# EasyEDA Pro project pcb最终版.epro, board master control
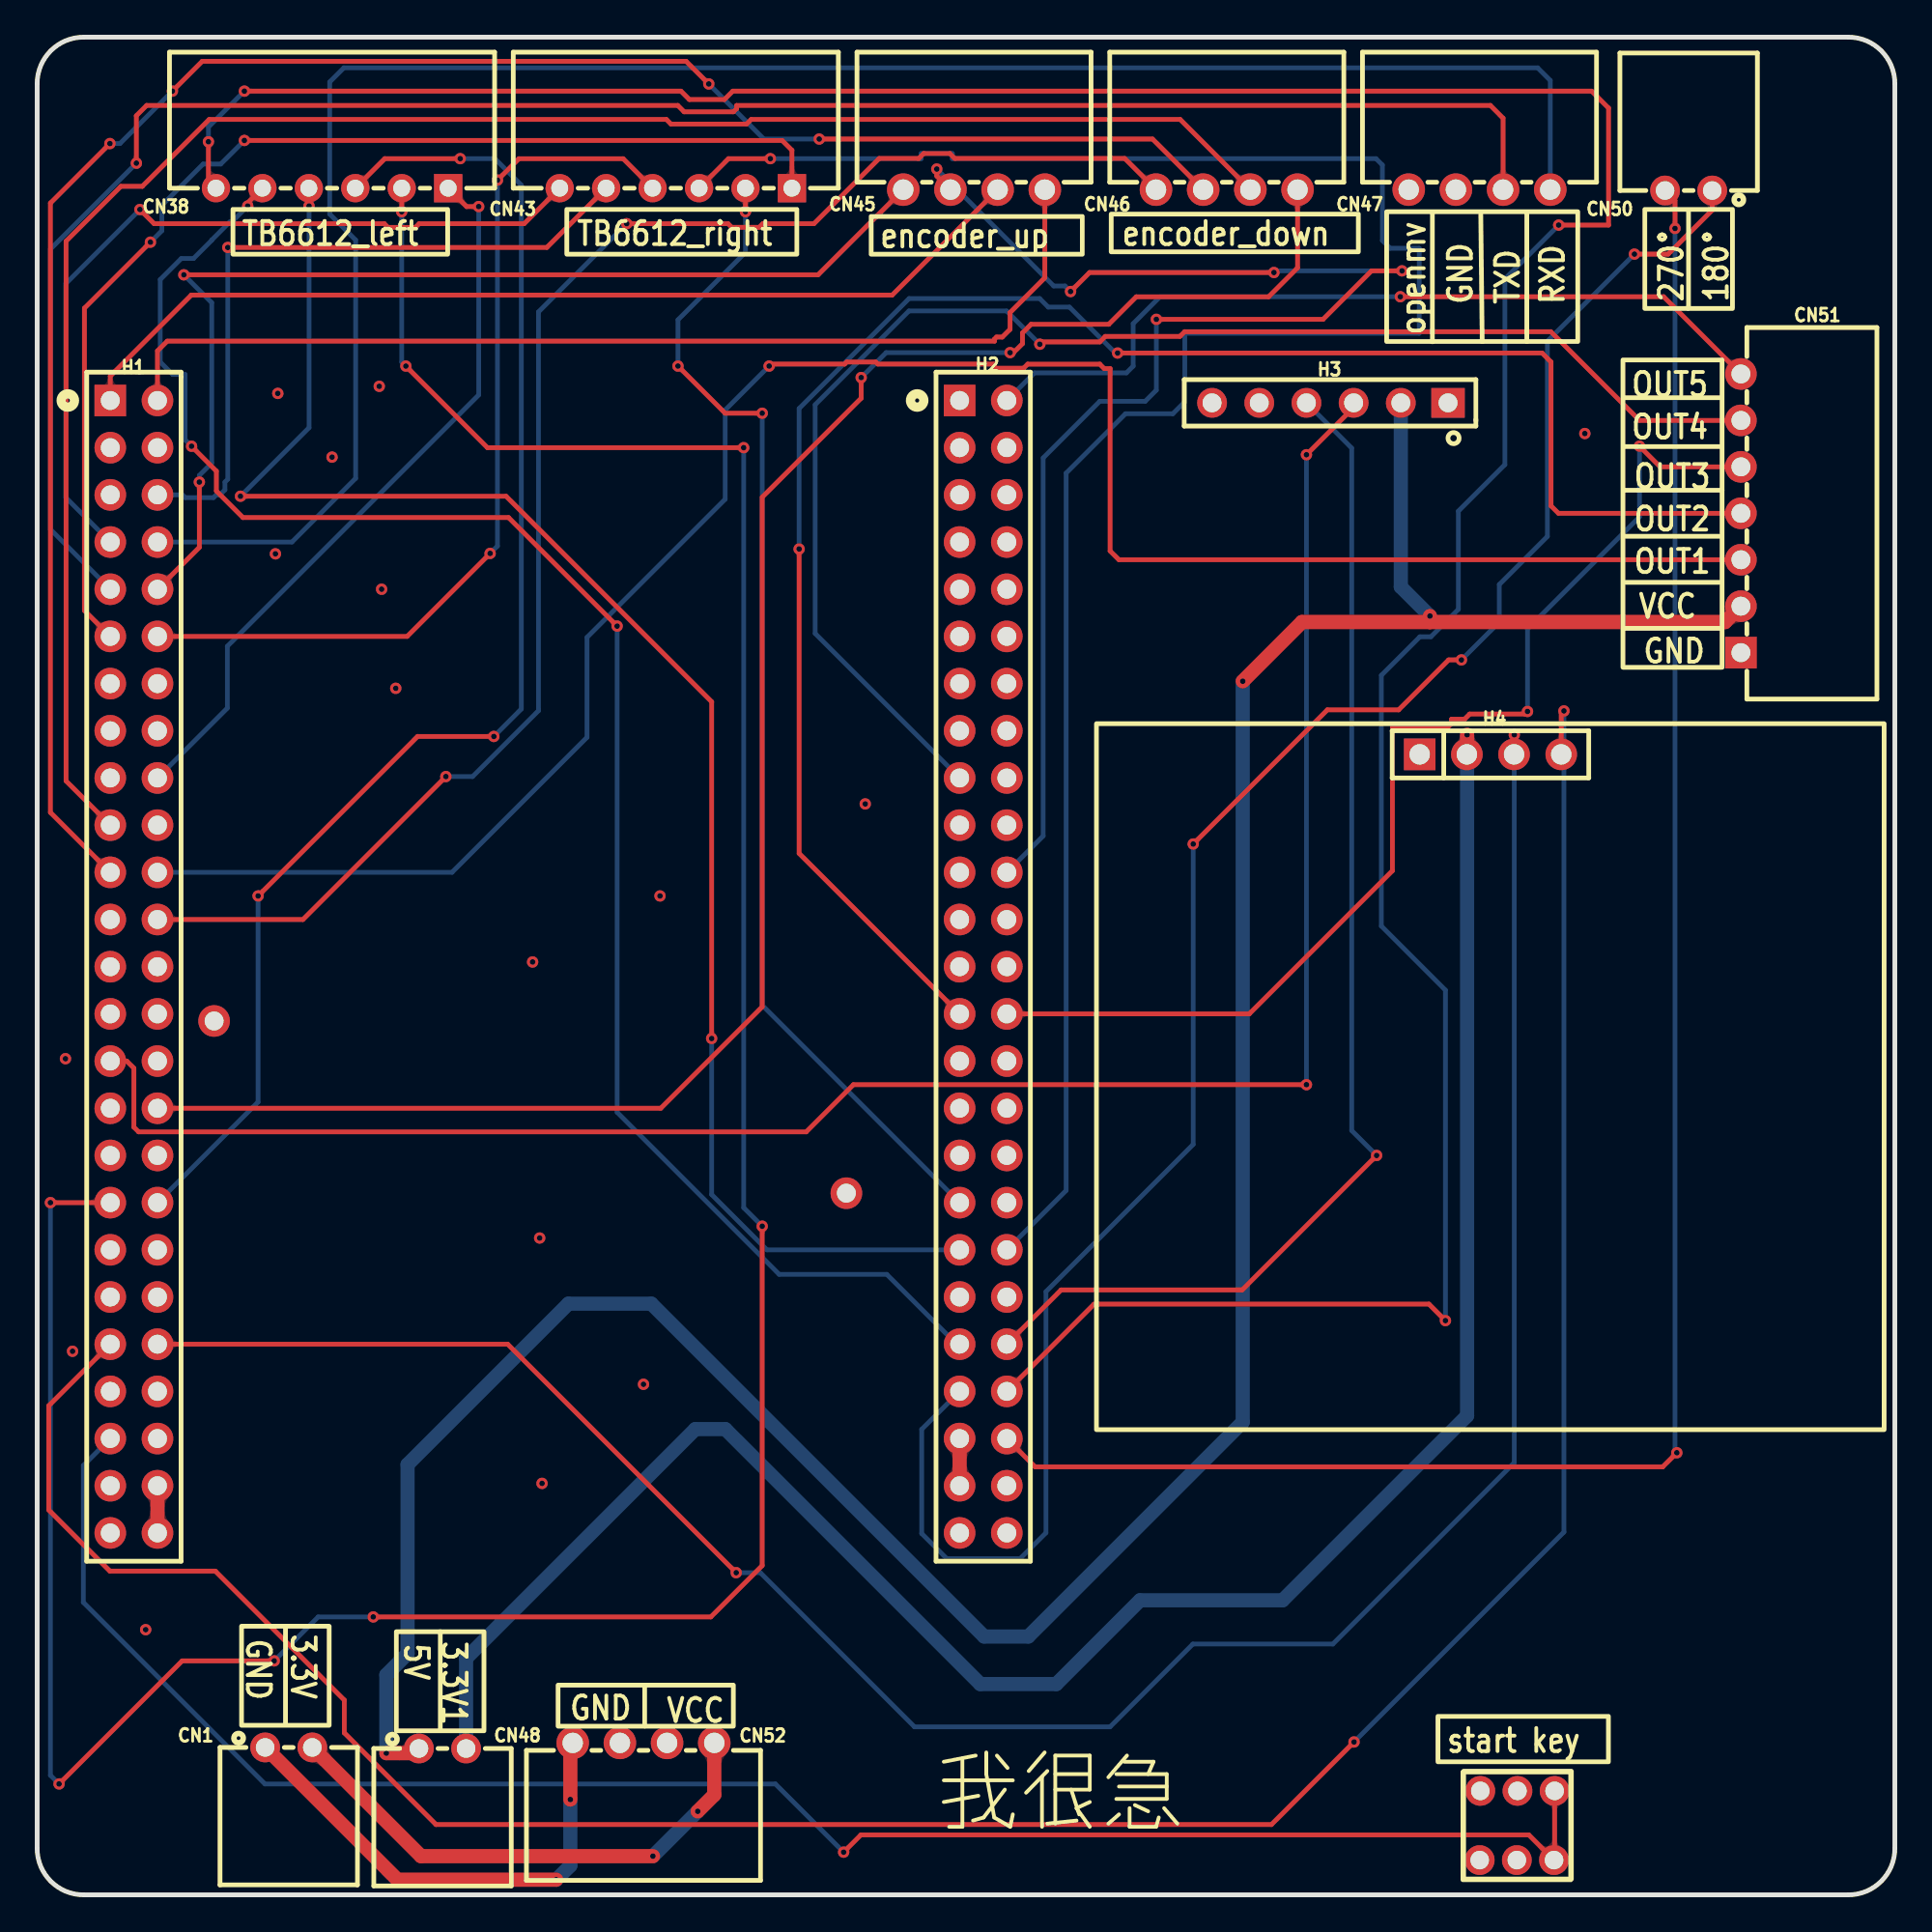
[diagram p3: board, top side]
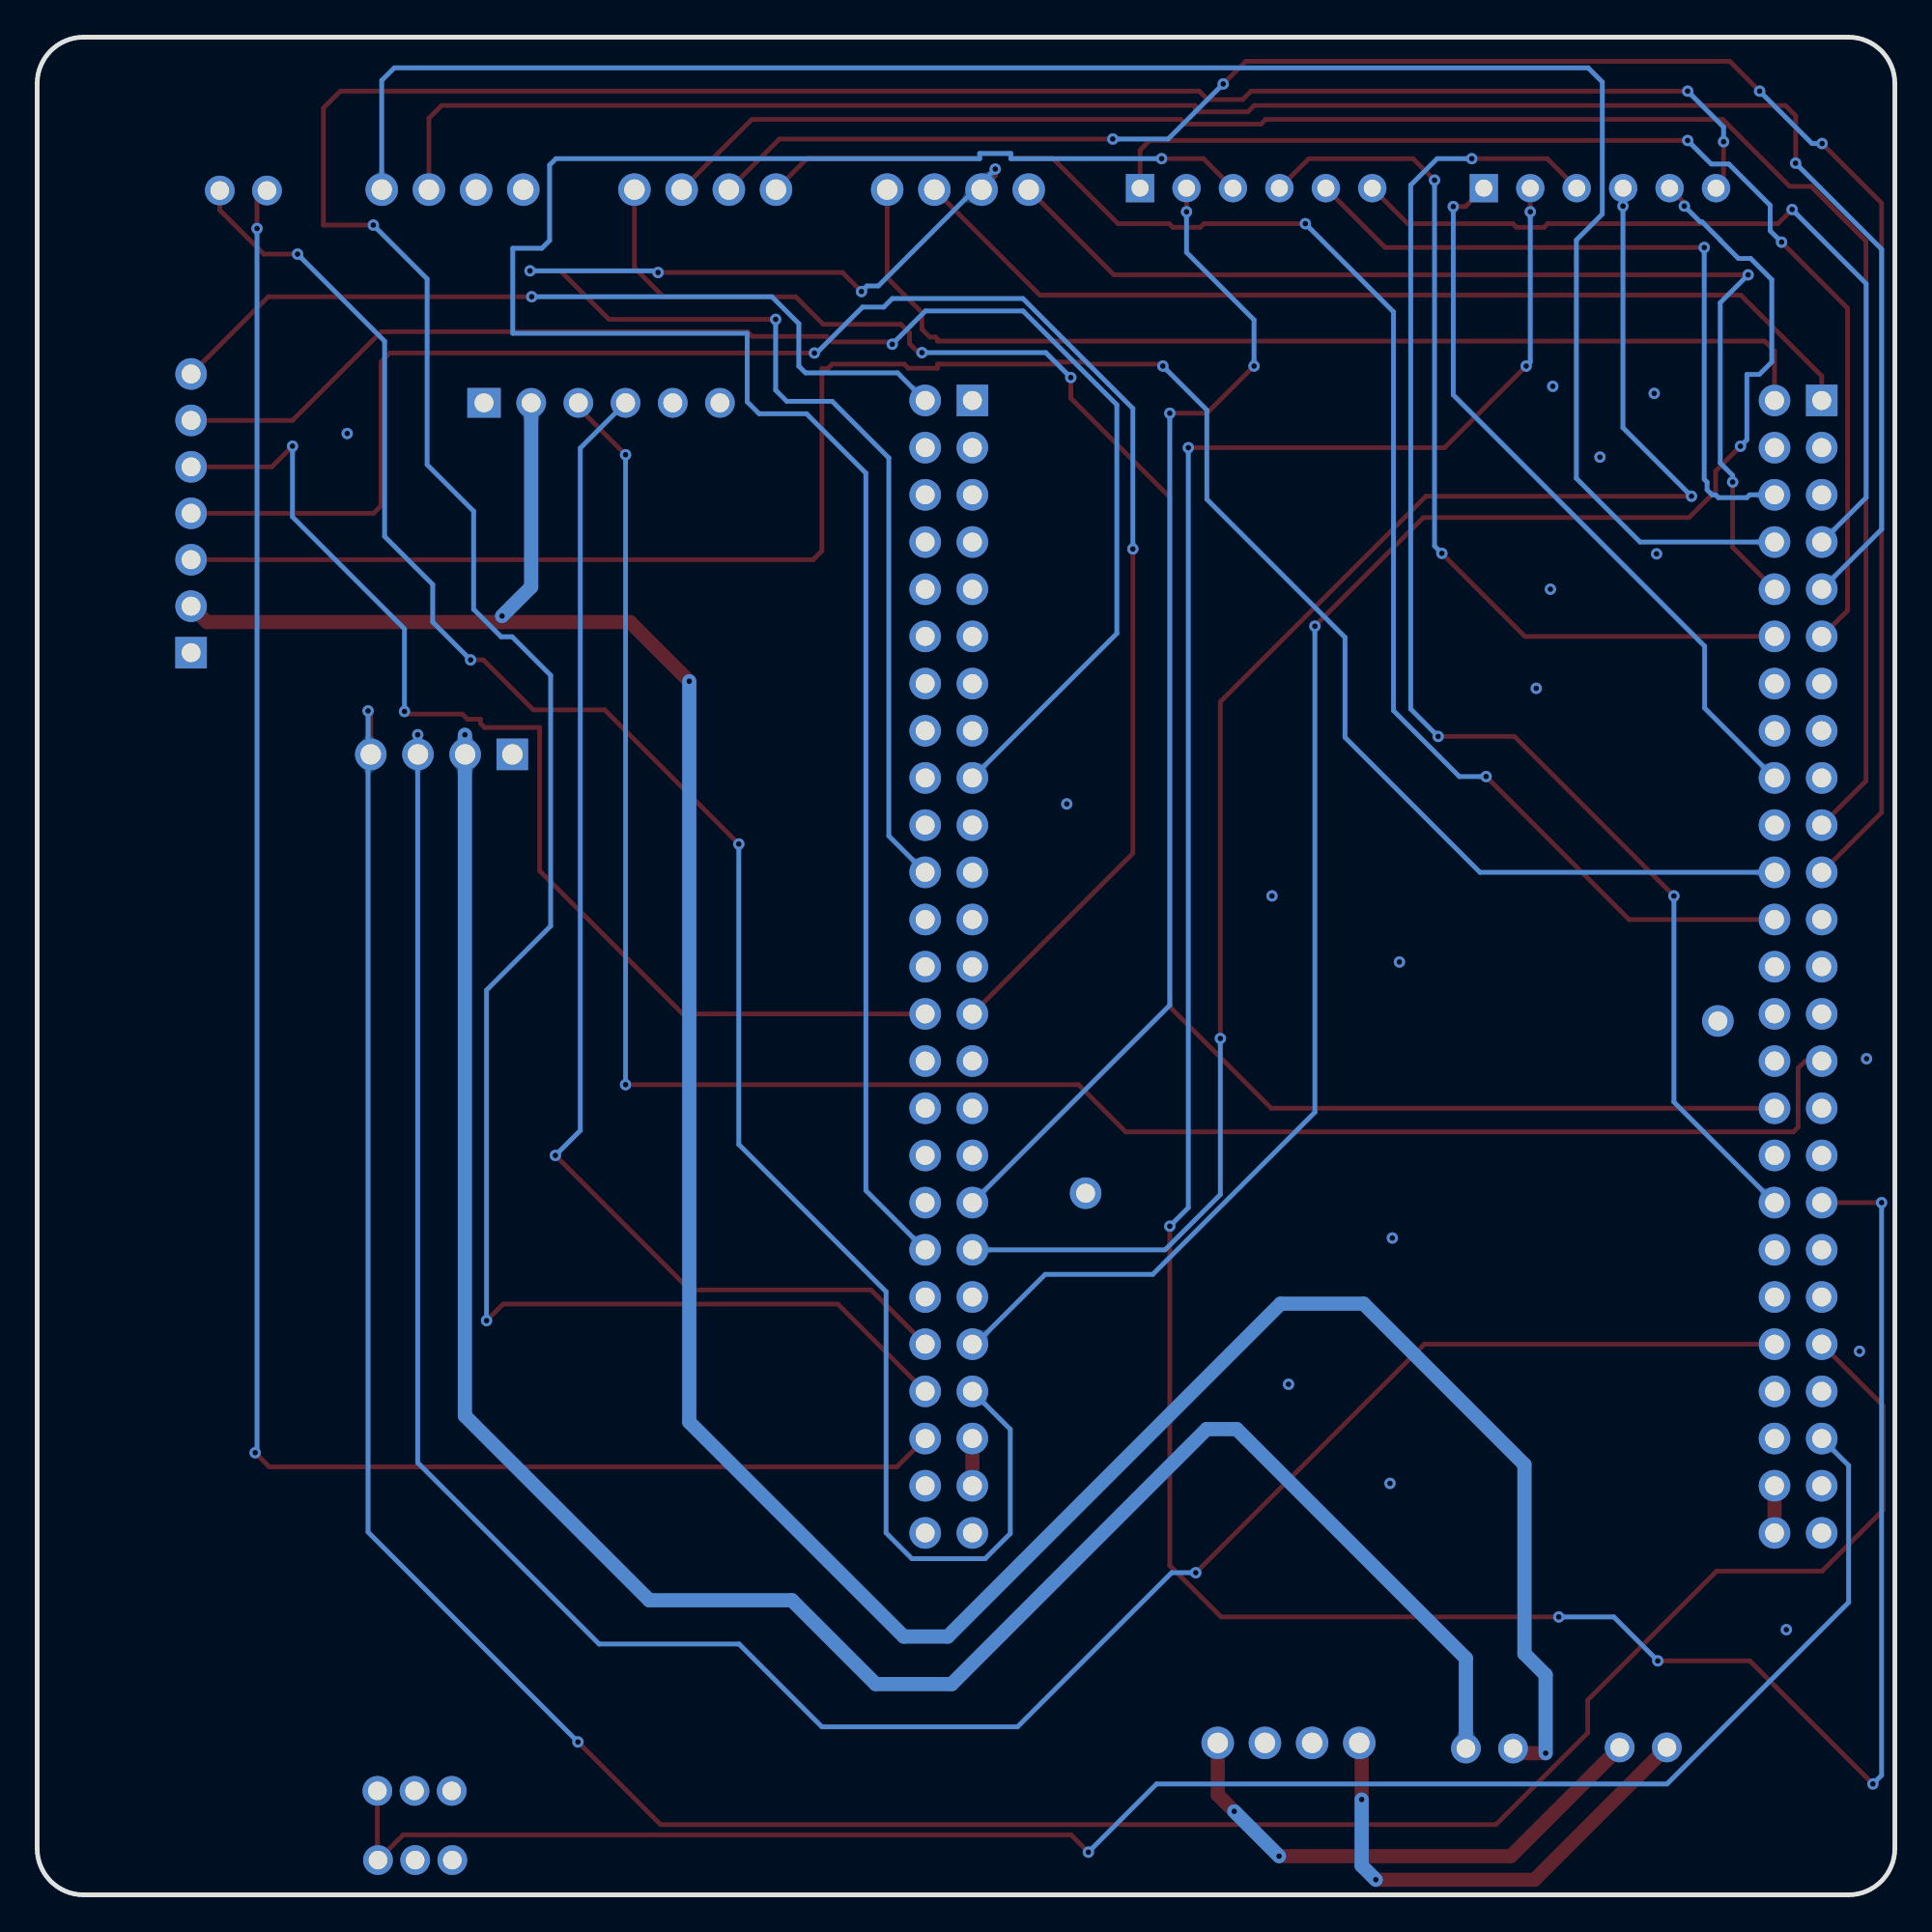
[diagram p4: board, bottom side, seen from below]

Outline 100 x 100 mm; copper layers: Top Layer, Bottom Layer. Coordinates in mm from the lower left corner of the outline.
Outline path: 0,97.5 0,2.5 arc(0.73,0.73) 2.5,0 97.5,0 arc(99.27,0.73) 100,2.5 100,97.5 arc(99.27,99.27) 97.5,100 2.5,100 arc(0.73,99.27) 0,97.5
Stack: Top Layer 0.035mm / Dielectric1 1.51mm FR4 er 4.5 / Bottom Layer 0.035mm

## Design rules (mm)
template: 我很急
spacing copperThickness1oz: track to track 0.102, other pairs 0.152 to 0.3
spacing copperThickness2oz (default): track to track 0.203, other pairs 0.203 to 0.203
spacing VCC和GND: track to track 0.762, other pairs 0.152 to 0.3
track width copperThickness1oz (default): min 0.254, default 0.254, max 1.016
track width copperThickness2oz: min 0.203, default 0.254, max 2.54
track width VCC AND GND: min 0.254, default 0.762, max 0.762
track width 9.6V: min 0.762, default 1.016, max 1.016
differential pair differentialPair (default): width min 0.127, default 0.254, max 2.54; gap min 0.152, default 0.152
via viaSize (default): diameter min 0.5, default 0.61, max 10; hole min 0.3, default 0.305, max 6.299
net GND uses VCC AND GND
net 5V uses VCC AND GND
net VREF uses VCC AND GND
net 3.3V uses VCC AND GND
net 3.3V1 uses VCC AND GND

## Placement (name value [footprint] x y rotation side)
CN1  3.3V  [CONN-TH_XH-2AW_C2908611]  13.54 7.94 0 top
CN38  TB6612 1  [CONN-TH_6P-P2.50_HC-XH-6AW-G]  15.88 91.87 180 top
CN43  TB6612 1  [CONN-TH_6P-P2.50_HC-XH-6AW-G]  34.38 91.87 180 top
CN45  编码器上  [CONN-TH_XH-4AW]  50.43 91.79 180 top
CN46  编码器下  [CONN-TH_XH-4AW]  64.04 91.79 180 top
CN47  openmv  [CONN-TH_XH-4AW]  77.64 91.79 180 top
CN48  3.3V  [CONN-TH_XH-2AW_C2908611]  21.82 7.88 0 top
CN50  SERVO  [CONN-TH_XH-2AW_C2908611]  88.9 91.75 180 top
CN51  HC-XH-7AW-G  [CONN-TH_7P-P2.50_HC-XH-7AW-G]  91.71 74.37 90 top
CN52  XH-4AW  [CONN-TH_XH-4AW]  32.64 8.18 0 top
H1  FH-00077  [HDR-TH_50P-P2.54-V-F-R2-C25-S2.54-1]  5.21 49.96 270 top
H2  FH-00077  [HDR-TH_50P-P2.54-V-F-R2-C25-S2.54-1]  50.93 49.96 270 top
H3  PM254V-11-06-H85  [HDR-TH_6P-P2.54-V-F]  69.6 80.31 180 top
H4  PM254V-11-04-H85  [HDR-TH_4P-P2.54-V-F]  78.23 61.39 0 top
NOREF  -  [Pad_e45397]  9.53 47.04 270 top
NOREF#2  -  [Pad_e45396]  43.56 37.77 270 top
U1  -  [按键开关]  77.42 5.77 0 top
U2  -  [按键开关]  81.91 1.7 180 top

## Footprints (pads in the part's own frame, mm; a bottom-side part is the same pattern mirrored in y, then rotated)
CONN-TH_6P-P2.50_HC-XH-6AW-G
  rect 1.524x1.524 hole 0.914: 1(-6.25,0)
  round 1.524 hole 0.914: 2(-3.75,0) 3(-1.25,0) 4(1.25,0) 5(3.75,0) 6(6.25,0)
CONN-TH_7P-P2.50_HC-XH-7AW-G
  rect 1.7x1.7 hole 1.02: 1(-7.5,0)
  round 1.7 hole 1.02: 2(-5,0) 3(-2.5,0) 4(0,0) 5(2.5,0) 6(5,0) 7(7.5,0)
CONN-TH_XH-2AW_C2908611
  round 1.6 hole 1: 1(-1.27,0) 2(1.27,0)
CONN-TH_XH-4AW
  round 1.75 hole 1.1: 1(-3.81,0) 2(-1.27,0) 3(1.27,0) 4(3.81,0)
HDR-TH_4P-P2.54-V-F
  rect 1.7x1.7 hole 1.1: 1(-3.81,0)
  round 1.7 hole 1.1: 2(-1.27,0) 3(1.27,0) 4(3.81,0)
HDR-TH_6P-P2.54-V-F
  rect 1.8x1.6 hole 1.02: 1(-6.35,0)
  round 1.6 hole 1.02: 2(-3.81,0) 3(-1.27,0) 4(1.27,0) 5(3.81,0) 6(6.35,0)
HDR-TH_50P-P2.54-V-F-R2-C25-S2.54-1
  rect 1.7x1.7 hole 1.02: 1(-30.48,-1.27)
  round 1.7 hole 1.02: 2(-30.48,1.27) 3(-27.94,-1.27) 4(-27.94,1.27) 5(-25.4,-1.27) 6(-25.4,1.27) 7(-22.86,-1.27) 8(-22.86,1.27) 9(-20.32,-1.27) 10(-20.32,1.27) 11(-17.78,-1.27) 12(-17.78,1.27) 13(-15.24,-1.27) 14(-15.24,1.27) 15(-12.7,-1.27) 16(-12.7,1.27) 17(-10.16,-1.27) 18(-10.16,1.27) 19(-7.62,-1.27) 20(-7.62,1.27) 21(-5.08,-1.27) 22(-5.08,1.27) 23(-2.54,-1.27) 24(-2.54,1.27) 25(0,-1.27) 26(0,1.27) 27(2.54,-1.27) 28(2.54,1.27) 29(5.08,-1.27) 30(5.08,1.27) 31(7.62,-1.27) 32(7.62,1.27) 33(10.16,-1.27) 34(10.16,1.27) 35(12.7,-1.27) 36(12.7,1.27) 37(15.24,-1.27) 38(15.24,1.27) 39(17.78,-1.27) 40(17.78,1.27) 41(20.32,-1.27) 42(20.32,1.27) 43(22.86,-1.27) 44(22.86,1.27) 45(25.4,-1.27) 46(25.4,1.27) 47(27.94,-1.27) 48(27.94,1.27) 49(30.48,-1.27) 50(30.48,1.27)
Pad_e45396
  round 1.7 hole 1.02: 1(0,0)
Pad_e45397
  round 1.7 hole 1.02: 51(0,0)
按键开关
  round 1.6 hole 1: 1(0.263,-0.17) 1(2.263,-0.17) 1(4.263,-0.17)

## Nets
As in the schematic, except:
3.3V: CN1.2 CN52.4
5V: CN48.1 CN51.2 H3.2
5V5: H1.48 H1.50
GND: CN1.1 CN47.3 CN51.1 CN52.1 H1.47 H1.49 H2.50 H3.5 H4.1 NOREF.51 NOREF#2.1 U1.1 U2.1

## Via types
v1: diameter 0.61, hole 0.305, Top Layer to Bottom Layer, 92 vias

## Routing (per net, layer and track width the routed paths; a pad name or vN(x,y) marks a point on that pad's centre or on a via; arc(x,y) is an arc through that point)
3.3V: length 28.2
  Top Layer w0.762: v1(35.56,4.5) 36.45,5.38 CN52.4 ; CN1.2 20.67,2.08 v1(33.15,2.08)
  Bottom Layer w0.762: v1(33.15,2.08) v1(35.56,4.5)
3.3V1: length 113.2
  Top Layer w0.762: H4.2 76.96,61.91 76.97,61.92 v1(76.97,62.45)
  Bottom Layer w0.762: CN48.2 23.09,12.73 35.43,25.07 37.05,25.07 50.77,11.35 54.86,11.35 59.37,15.86 67.05,15.86 76.97,25.79 v1(76.97,62.45)
5V: length 159.4
  Top Layer w0.762: v1(64.9,65.33) 68.08,68.52 74.97,68.52 ; v1(18.8,7.63) 20.3,7.63 CN48.1 ; 74.97,68.52 90.86,68.52 CN51.2 ; 74.97,68.52 v1(74.97,68.84)
  Bottom Layer w0.762: v1(74.97,68.84) 73.41,70.41 H3.2 ; v1(64.9,65.33) 64.9,25.45 53.35,13.9 50.98,13.9 33.06,31.82 28.6,31.82 19.94,23.16 19.94,12.98 18.8,11.84 v1(18.8,7.63)
5V5: length 2.5
  Top Layer w0.762: H1.48 H1.50
GND: length 26.4
  Top Layer w0.762: v1(27.94,0.81) 19.39,0.81 CN1.1 ; v1(28.7,5.13) 28.7,8.05 CN52.1
  Bottom Layer w0.762: v1(27.94,0.81) 28.7,1.57 v1(28.7,5.13)
  vias: v1(1.52,45.01) v1(1.91,29.26) v1(5.84,14.28) v1(12.83,72.19) v1(12.95,80.82) v1(15.88,77.39) v1(18.42,81.2) v1(18.54,70.28) v1(19.3,64.95) v1(26.67,50.22) v1(27.05,35.36) v1(27.18,22.15) v1(32.64,27.48) v1(33.53,53.77) v1(44.58,58.72) v1(83.31,78.66)
PA1: length 105.2
  Top Layer w0.254: CN50.2 88.17,91.21 v1(88.17,89.7) ; H2.46 53.72,23.04 87.5,23.04 v1(88.26,23.8)
  Bottom Layer w0.254: v1(88.26,23.8) 88.17,23.9 v1(88.17,89.7)
PA2: length 107.2
  Top Layer w0.254: v1(85.98,88.32) 87.8,88.32 90.17,90.69 CN50.1 ; v1(62.23,56.57) 69.45,63.79 73.29,63.79 75.98,66.48 v1(76.67,66.48)
  Bottom Layer w0.254: v1(62.23,56.57) 62.23,40.4 54.3,32.47 54.3,19.49 52.91,18.1 48.97,18.1 47.62,19.45 47.62,25.06 H2.43 ; v1(85.98,88.32) 81.3,83.63 81.3,73.12 78.71,70.54 78.71,68.52 v1(76.67,66.48)
PA3: length 66.2
  Top Layer w0.254: v1(72.1,39.8) 64.87,32.56 55.12,32.56 H2.42
  Bottom Layer w0.254: v1(72.1,39.8) 70.76,41.14 70.76,77.88 H3.4
PA6: length 40
  Top Layer w0.254: v1(23.77,90.88) 23.12,90.88 CN38.1
  Bottom Layer w0.254: H1.18 10.24,63.88 10.24,67.21 23.77,80.74 v1(23.77,90.88)
PA7: length 89.2
  Top Layer w0.254: CN38.4 14.64,91.86 v1(14.64,90.91) ; v1(36.31,46.1) 36.31,64.22 25.24,75.29 v1(10.95,75.29)
  Bottom Layer w0.254: v1(10.95,75.29) 14.64,78.98 v1(14.64,90.91) ; H2.37 39.28,34.72 36.31,37.7 v1(36.31,46.1)
PA8: length 59.4
  Top Layer w0.254: CN45.4 42.04,87.21 v1(7.9,87.21) ; H1.10 8.73,72.54 v1(8.73,76.05)
  Bottom Layer w0.254: v1(8.73,76.05) 8.73,76.41 9.4,77.08 9.4,85.71 v1(7.9,87.21)
PA15: length 84.4
  Top Layer w0.254: H1.24 14.31,52.5 v1(22,60.2) ; CN46.4 58.55,93.47 49.4,93.47 49.13,93.74 47.72,93.74 47.45,93.47 45.32,93.47 41.81,89.96 39.07,89.96 38.87,89.76 37.39,89.76 37.19,89.96 v1(31.74,89.96)
  Bottom Layer w0.254: v1(22,60.2) 23.44,60.2 26.99,63.74 26.99,85.21 v1(31.74,89.96)
PB3: length 105.4
  Top Layer w0.254: v1(36.16,97.48) 34.94,98.7 8.89,98.7 v1(7.28,97.09) ; H1.21 0.71,58.26 0.71,91.07 v1(3.92,94.27) ; v1(42.1,94.52) 60.04,94.52 CN46.3
  Bottom Layer w0.254: v1(42.1,94.52) 39.12,94.52 v1(36.16,97.48) ; v1(3.92,94.27) 4.46,94.27 v1(7.28,97.09)
PB4: length 98.8
  Top Layer w0.254: v1(43.41,2.3) 44.34,3.23 80.3,3.23 81.65,1.87 81.69,1.91 81.69,5.6
  Bottom Layer w0.254: v1(43.41,2.3) 39.74,5.97 12.26,5.97 2.49,15.74 2.49,23.11 H1.45
PB6: length 100.7
  Top Layer w0.254: H1.19 1.56,59.96 1.56,89.02 4.51,91.97 5.66,91.97 9.26,95.57 33.87,95.57 34.12,95.32 38.19,95.32 38.44,95.57 61.53,95.57 CN46.2
PB7: length 101.4
  Top Layer w0.254: CN46.1 67.85,87.58 66.29,86.02 59.17,86.02 57.69,84.54 53.51,84.54 53.04,84.08 53.04,83.5 52.56,83.02 v1(52.37,83.02) ; H1.32 33.57,42.34 39.03,47.8 39.03,75.24 44.36,80.57 v1(44.36,81.68)
  Bottom Layer w0.254: v1(52.37,83.02) 45.7,83.02 v1(44.36,81.68)
PB11: length 113
  Top Layer w0.254: CN51.3 58.23,71.87 57.76,72.34 57.76,82.16 57.44,82.16 57.2,82.4 53.32,82.4 53.1,82.18 51.53,82.18 51.53,82.37 51.51,82.4 45.25,82.4 45.14,82.51 43.58,82.51 43.46,82.4 39.51,82.4 v1(39.4,82.3)
  Bottom Layer w0.254: H1.22 22.33,55.04 29.6,62.31 29.6,67.69 37.04,75.13 37.04,79.93 v1(39.4,82.3)
PB12: length 98.6
  Top Layer w0.254: H2.27 41.02,56.06 v1(41.02,72.45) ; v1(58.16,83) 81.01,83 81.49,82.52 81.49,74.77 81.89,74.37 CN51.4
  Bottom Layer w0.254: v1(58.16,83) 58.04,83 55.57,85.47 54.43,85.47 53.97,85.93 46.94,85.93 41.02,80.01 v1(41.02,72.45)
PB13: length 62.1
  Top Layer w0.254: CN51.5 87.37,76.87 v1(86.25,77.98) ; H2.28 65.25,47.42 72.95,55.13 72.95,62.83 75.91,62.83 76.14,63.06 76.14,63.28 76.84,63.28 77.11,63.56 80.09,63.56 v1(80.23,63.7)
  Bottom Layer w0.254: v1(80.23,63.7) 80.23,68.15 86.25,74.17 v1(86.25,77.98)
PB15: length 44.9
  Top Layer w0.254: v1(73.38,86.03) 87.56,86.03 CN51.7
  Bottom Layer w0.254: v1(73.38,86.03) 60.45,86.03 59,84.58 59,82.29 58.64,81.93 53.68,81.93 H2.2
PC0: length 75.5
  Top Layer w0.254: v1(24.58,62.36) 20.48,62.36 v1(11.89,53.77) ; v1(22.77,93.46) 18.71,93.46 CN38.3
  Bottom Layer w0.254: v1(11.89,53.77) 11.89,42.68 H1.36 ; v1(24.58,62.36) 26.06,63.84 26.06,92.03 24.64,93.46 v1(22.77,93.46)
PC1: length 167.7
  Top Layer w0.254: v1(19.85,82.29) 24.24,77.9 v1(38.03,77.9) ; H1.35 v1(0.71,37.26) ; v1(12.76,12.59) 7.8,12.59 v1(1.18,5.97) ; v1(18.09,14.96) 36.26,14.96 39.03,17.73 v1(39.03,35.99) ; v1(19.62,90.6) CN38.2
  Bottom Layer w0.254: v1(18.09,14.96) 15.13,14.96 v1(12.76,12.59) ; v1(0.71,37.26) 0.71,6.44 v1(1.18,5.97) ; v1(39.03,35.99) 38.03,36.99 v1(38.03,77.9) ; v1(19.85,82.29) 19.62,82.52 v1(19.62,90.6)
PC2: length 95
  Top Layer w0.254: v1(8.31,77.98) 9.65,76.64 9.65,75.57 11.08,74.14 25.38,74.14 v1(31.22,68.3) ; v1(11.33,90.91) 11.33,91.08 CN38.5
  Bottom Layer w0.254: H2.41 49.49,29.64 45.74,33.4 39.95,33.4 31.22,42.13 v1(31.22,68.3) ; v1(11.33,90.91) 10.47,90.05 10.37,90.05 9.4,89.08 9.4,89.07 8.42,88.09 7.76,88.09 6.63,86.95 6.63,82.51 7.3,81.84 7.97,81.84 7.97,78.32 v1(8.31,77.98)
PC3: length 180
  Top Layer w0.254: H2.44 56.9,31.8 74.92,31.8 v1(75.81,30.91) ; v1(9.22,94.37) 9.22,92.28 CN38.6 ; v1(11.15,97.09) 34.66,97.09 35.11,96.64 36.99,96.64 37.45,97.09 83.68,97.09 84.59,96.18 84.59,89.88 v1(81.91,89.88)
  Bottom Layer w0.254: v1(11.15,97.09) 9.22,95.16 v1(9.22,94.37) ; v1(75.81,30.91) 75.81,48.7 72.36,52.15 72.36,65.65 74.43,67.72 75.03,67.72 76.5,69.2 76.5,74.48 79.01,76.99 79.01,86.99 v1(81.91,89.88)
PC4: length 116.4
  Top Layer w0.254: CN43.3 37.22,93.46 v1(39.47,93.46)
  Bottom Layer w0.254: v1(39.47,93.46) 47.59,93.46 47.59,93.74 49.26,93.74 49.26,93.46 72.07,93.46 72.41,93.12 72.41,89.05 72.83,88.64 74.4,88.64 74.4,84.06 61.78,84.06 61.78,80.37 61.13,79.73 58.58,79.73 55.39,76.53 55.39,37.92 H2.38
PC5: length 63.6
  Top Layer w0.254: v1(38.13,90.6) CN43.2 ; v1(39.03,79.76) 37.03,79.76 v1(34.5,82.3)
  Bottom Layer w0.254: v1(39.03,79.76) 39.03,47.89 H2.35 ; v1(34.5,82.3) 34.5,84.78 38.13,88.42 v1(38.13,90.6)
PC6: length 53.2
  Top Layer w0.254: H1.1 3.94,81.76 8.3,86.12 46.03,86.12 CN45.2
PC7: length 57.4
  Top Layer w0.254: H1.2 6.48,83.11 7,83.64 51.53,83.64 51.53,83.75 51.64,83.86 51.95,83.86 52.37,84.28 52.37,85.18 54.24,87.05 CN45.1
PC8: length 63.1
  Top Layer w0.254: v1(6.1,88.96) 2.55,85.41 2.55,69.13 H1.11 ; CN43.1 40.63,93.92 40.1,94.44 v1(11.15,94.44)
  Bottom Layer w0.254: v1(11.15,94.44) 9.89,93.17 8.93,93.17 6.71,90.95 6.71,89.58 v1(6.1,88.96)
PC9: length 49.5
  Top Layer w0.254: H1.12 19.92,67.74 v1(24.38,72.21) ; v1(24.78,92.3) 25.93,93.46 31.54,93.46 CN43.4
  Bottom Layer w0.254: v1(24.38,72.21) 24.78,72.61 v1(24.78,92.3)
PC10: length 38.7
  Top Layer w0.254: CN43.5 27.44,88.68 v1(10.26,88.68)
  Bottom Layer w0.254: H1.6 7.82,75.36 7.97,75.21 9.49,75.21 9.64,75.36 9.84,75.36 10.11,75.63 10.11,76.05 10.26,76.2 v1(10.26,88.68)
PC11: length 44.4
  Top Layer w0.254: CN43.6 26.22,89.96 20.56,89.96 20.37,89.76 18.89,89.76 18.69,89.96 6.3,89.96 v1(5.53,90.72)
  Bottom Layer w0.254: v1(5.53,90.72) 1.54,86.73 1.54,75.22 H1.7
PC12: length 107.1
  Top Layer w0.254: CN47.2 78.91,95.64 78.23,96.32 37.65,96.32 37.65,96.15 37.48,95.98 34.83,95.98 34.49,96.32 5.89,96.32 5.34,95.77 5.34,93.22 v1(5.34,93.22)
  Bottom Layer w0.254: v1(5.34,93.22) 0.71,88.58 0.71,73.51 H1.9
PD2: length 106.2
  Bottom Layer w0.254: CN47.1 81.45,97.67 80.77,98.35 16.51,98.35 15.75,97.59 15.75,90.47 17.14,89.08 17.14,76.25 13.72,72.82 H1.8
PD5: length 106.6
  Top Layer w0.254: v1(68.33,77.52) 70.87,80.06 H3.3 ; H1.29 4.83,44.88 5.21,44.5 5.21,41.33 5.46,41.07 41.4,41.07 43.94,43.61 v1(68.33,43.61)
  Bottom Layer w0.254: v1(68.33,77.52) v1(68.33,43.61)
PE11: length 78.5
  Top Layer w0.254: v1(60.25,84.81) 69.22,84.81 71.83,87.42 v1(73.47,87.42) ; 49.16,91.79 48.43,92.53 v1(48.43,92.9) ; v1(55.63,86.31) 56.65,87.33 v1(66.58,87.33)
  Bottom Layer w0.254: v1(48.43,92.9) 54.72,86.61 55.33,86.61 v1(55.63,86.31) ; H2.22 54.16,57 54.16,77.35 57.2,80.4 59.64,80.4 60.25,81 v1(60.25,84.81) ; v1(73.47,87.42) 66.67,87.42 v1(66.58,87.33)
PE13: length 78.2
  Top Layer w0.254: CN51.6 86.26,79.37 81.48,84.14 61.77,84.14 61.51,83.89 57.5,83.89 57.2,83.6 54.1,83.6 v1(53.97,83.47)
  Bottom Layer w0.254: v1(53.97,83.47) 52.18,85.26 46.93,85.26 41.88,80.21 41.88,67.9 H2.17
PG11: length 153
  Top Layer w0.254: H1.41 0.63,26.33 0.63,20.72 3.92,17.43 9.59,17.43 16.53,10.49 16.53,8.72 21.47,3.78 66.44,3.78 v1(70.89,8.23) ; H4.4 82.04,63.59 v1(82.19,63.73)
  Bottom Layer w0.254: v1(82.19,63.73) 82.19,19.53 v1(70.89,8.23)
PG12: length 127.7
  Top Layer w0.254: H4.3 79.5,62.43 v1(79.51,62.45) ; v1(37.63,17.34) 25.33,29.64 H1.42
  Bottom Layer w0.254: v1(37.63,17.34) 38.93,17.34 47.23,9.04 57.75,9.04 62.21,13.5 69.75,13.5 79.51,23.27 v1(79.51,62.45)
VREF: length 2.5
  Top Layer w0.762: H2.45 H2.47

## Copper pours and planes (outline as drawn; the poured copper is in the pictures)
GND on Top Layer: 0.25,99.87 100.58,99.87 100.58,-0.46 0.25,-0.46
GND on Bottom Layer: -0.1,99.87 100.46,99.87 100.46,-0.58 -0.1,-0.58

Small or netless copper shapes (teardrops, artwork), in the pictures only: 128 on Top Layer, 101 on Bottom Layer

## Text on the board
Top Silkscreen Layer: openmv | GND | TXD | RXD | TB6612_left | TB6612_right | VCC | encoder_up | encoder_down | start key | OUT5 | OUT4 | OUT3 | OUT2 | OUT1 | 270° | 180° | 3.3V | 5V | 3.3V1 | 我很急
